# Altium schematic sheet BATT_CHG.SchDoc
size C; SheetNumber: 5; SheetTotal: 8
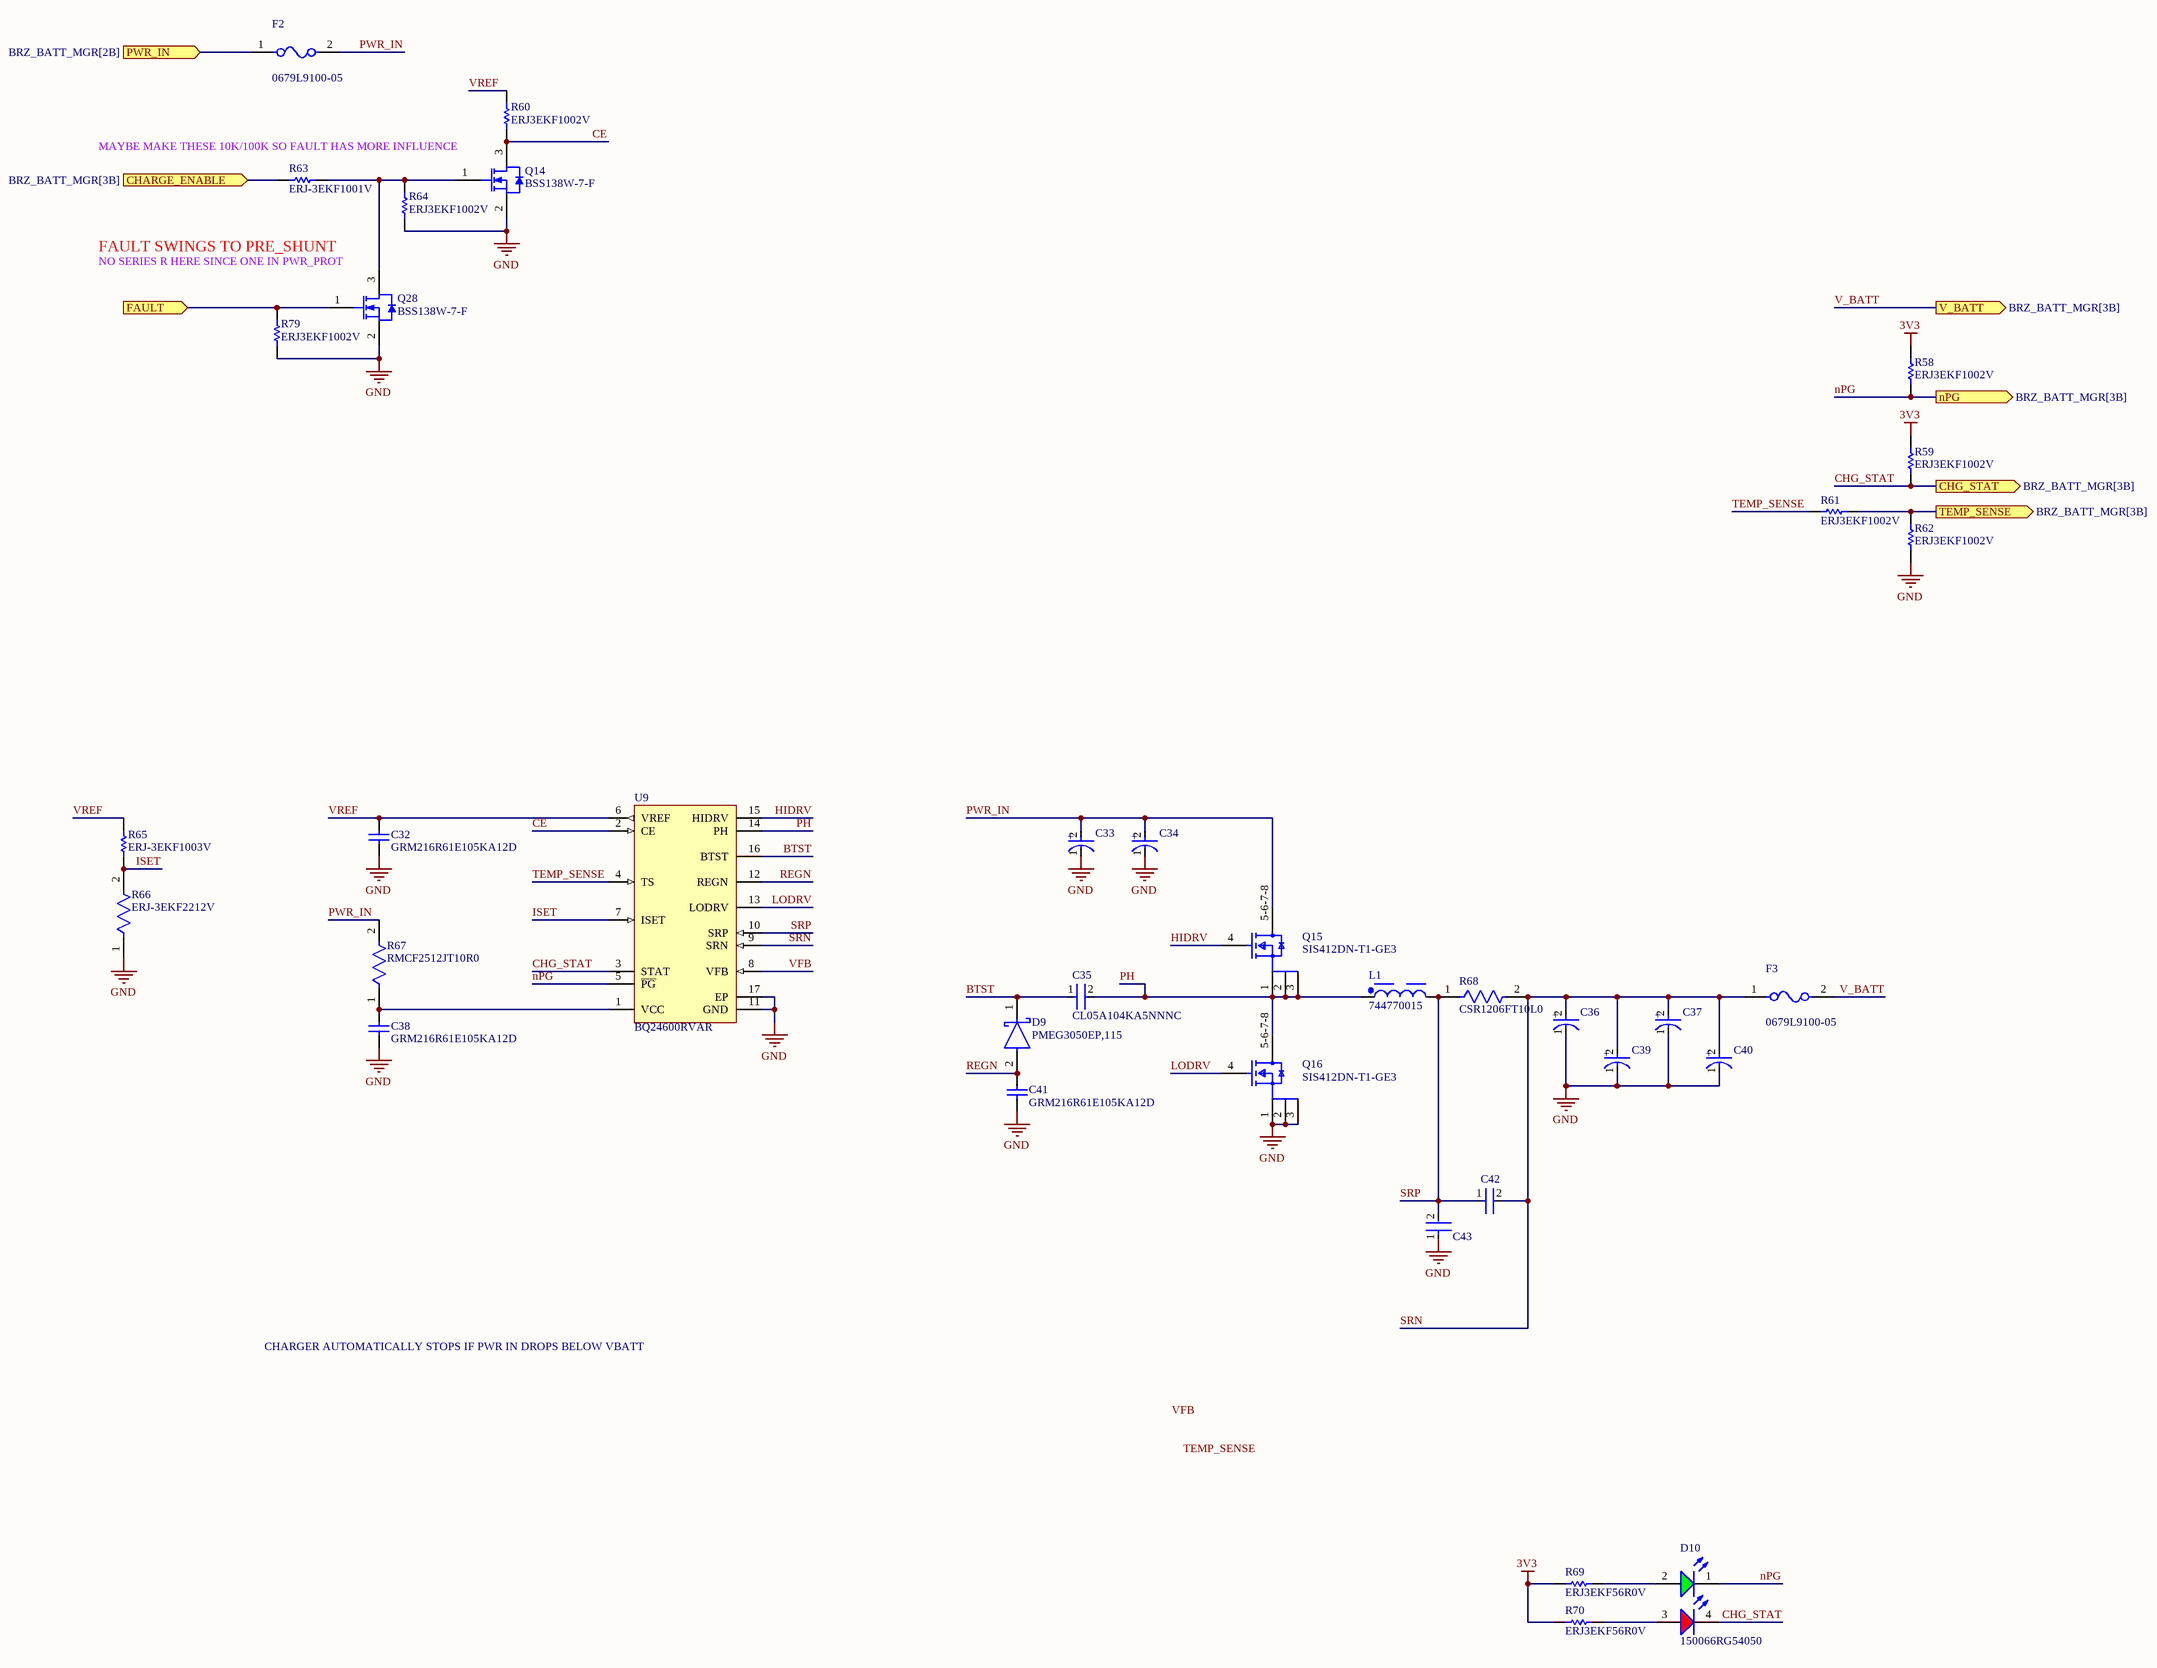
[diagram p0: BATT_CHG.SchDoc]

## Parts
C32  GRM216R61E105KA12D  [CAPC2013X70X45NL10T25]
C33  50SVPF10M  [FP-OS-CON-SMT-C6-MFG]  (value not drawn)
C34  50SVPF10M  [FP-OS-CON-SMT-C6-MFG]  (value not drawn)
C35  CL05A104KA5NNNC  [FP-CL278-IPC_C]
C36  50SVPF10M  [FP-OS-CON-SMT-C6-MFG]  (value not drawn)
C37  50SVPF10M  [FP-OS-CON-SMT-C6-MFG]  (value not drawn)
C38  GRM216R61E105KA12D  [CAPC2013X70X45NL10T25]
C39  50SVPF10M  [FP-OS-CON-SMT-C6-MFG]  (value not drawn)
C40  50SVPF10M  [FP-OS-CON-SMT-C6-MFG]  (value not drawn)
C41  GRM216R61E105KA12D  [CAPC2013X70X45NL10T25]
C42  CL05A104KA5NNNC  [FP-CL278-IPC_C]  (value not drawn)
C43  CL05A104KA5NNNC  [FP-CL278-IPC_C]  (value not drawn)
D9  PMEG3050EP,115  [FP-SOD128-MFG]
D10  150066RG54050  [WL-SBCD_0606]
F2  0679L9100-05  [FP-0679L-MFG]
F3  0679L9100-05  [FP-0679L-MFG]
L1  744770015  [WE-PD_1280]
Q14  BSS138W-7-F  [DIOD-SOT323-3_V]
Q15  SIS412DN-T1-GE3  [FP-S16-2667-SINGLE-MFG]
Q16  SIS412DN-T1-GE3  [FP-S16-2667-SINGLE-MFG]
Q28  BSS138W-7-F  [DIOD-SOT323-3_V]
R58  ERJ3EKF1002V  [RESC1609X55X30LL15T15]
R59  ERJ3EKF1002V  [RESC1609X55X30LL15T15]
R60  ERJ3EKF1002V  [RESC1609X55X30LL15T15]
R61  ERJ3EKF1002V  [RESC1609X55X30LL15T15]
R62  ERJ3EKF1002V  [RESC1609X55X30LL15T15]
R63  ERJ-3EKF1001V  [RESC1608X55X30LL15T15]
R64  ERJ3EKF1002V  [RESC1609X55X30LL15T15]
R65  ERJ-3EKF1003V  [RESC1608X55X30ML15T15]
R66  ERJ-3EKF2212V  [FP-ERJ3EK-MFG]
R67  RMCF2512JT10R0  [FP-RMCF2512-IPC_B]
R68  CSR1206FT10L0  [FP-CSR1206-IPC_C]
R69  ERJ3EKF56R0V  [RESC1608X55X30NL15T15]
R70  ERJ3EKF56R0V  [RESC1608X55X30NL15T15]
R79  ERJ3EKF1002V  [RESC1609X55X30LL15T15]
U9  BQ24600RVAR  [RVA0016A_V]

## Ports
CHARGE_ENABLE (in, see BRZ_BATT_MGR[3B]), CHG_STAT (out, see BRZ_BATT_MGR[3B]), FAULT (in), nPG (out, see BRZ_BATT_MGR[3B]), PWR_IN (in, see BRZ_BATT_MGR[2B]), TEMP_SENSE (out, see BRZ_BATT_MGR[3B]), V_BATT (out, see BRZ_BATT_MGR[3B])

## Nets
3V3: R58.2 R59.2 R69.2 R70.2
GND: C32.1 C33.1(C) C34.1(C) C36.1(C) C37.1(C) C38.1 C39.1(C) C40.1(C) C41.1 C43.1 Q14.2(S) Q16.1(S) Q16.2(S) Q16.3(S) Q28.2(S) R62.1 R64.1 R66.1 R79.1 U9.11(GND) U9.17(EP)
BTST: C35.1 D9.1(C) U9.16(BTST)
CE: Q14.3(D) R60.1 U9.2(CE)
CHARGE_ENABLE: R63.2 ; port CHARGE_ENABLE
CHG_STAT: D10.4(K) R59.1 U9.3(STAT) ; port CHG_STAT
FAULT: Q28.1(G) R79.2 ; port FAULT
HIDRV: Q15.4(G) U9.15(HIDRV)
ISET: R65.1 R66.2 U9.7(ISET)
LODRV: Q16.4(G) U9.13(LODRV)
nPG: D10.1(K) R58.1 U9.5(~{PG}) ; port nPG
PH: C35.2 L1.1 Q15.1(S) Q15.2(S) Q15.3(S) Q16.5-6-7-8(D) U9.14(PH)
PWR_IN: C33.2(A) C34.2(A) F2.2 Q15.5-6-7-8(D) R67.2
PWR_IN: F2.1 ; port PWR_IN  [a separate net that carries the same name]
REGN: C41.2 D9.2(A) U9.12(REGN)
SRN: C36.2(A) C37.2(A) C39.2(A) C40.2(A) C42.2 F3.1 R68.2 U9.9(SRN)
SRP: C42.1 C43.2 L1.2 R68.1 U9.10(SRP)
TEMP_SENSE: R61.2 U9.4(TS)
TEMP_SENSE: R61.1 R62.2 ; port TEMP_SENSE  [a separate net that carries the same name]
V_BATT: F3.2 ; port V_BATT
VFB: U9.8(VFB)
VREF: C32.2 R60.2 R65.2 U9.6(VREF)
NetC38_2: C38.2 R67.1 U9.1(VCC)
NetD10_2: D10.2(A) R69.1
NetD10_3: D10.3(A) R70.1
NetQ14_1: Q14.1(G) Q28.3(D) R63.1 R64.2

## Notes on the sheet
- MAYBE MAKE THESE 10K/100K SO FAULT HAS MORE INFLUENCE
- FAULT SWINGS TO PRE_SHUNT
- NO SERIES R HERE SINCE ONE IN PWR_PROT
- CHARGER AUTOMATICALLY STOPS IF PWR IN DROPS BELOW VBATT
- Labels drawn without touching a wire or pin: TEMP_SENSE, VFB
- (in symbol CMP-05428-000804-1) +

## Library data of the parts
C32 C38 C41 = CMP-2007-00957-1: Manufacturer: Murata; Part Number: GRM216R61E105KA12D
C33 C34 C36 C37 C39 C40 = CMP-05428-000804-1: Conductive Polymer Aluminum Solid Capacitors (OS-CON) 10uF ±20% 50V; ESR (Equivalent Series Resistance): 40mR; Ripple Current: 2.5A; Leakage Current: 100uA; Life (Hours): 5000Hour; Dissipation Factor: 12%; Voltage Rating (DC): 50V; Termination: SMD/SMT; Voltage Rating: 50V; Voltage: 50V; Min Operating Temperature: -55°C; Max Operating Temperature: 105°C; Height - Seated (Max): 0.236inch; Case/Package: Radial; Mount: Surface Mount; Height: 5.9mm; RoHS Compliant: Yes; Diameter: 6.3mm; Construction: Cylindrical; Ripple Current (AC): 2.5A; Series: OS-CON, SVPF; Length: 5.9mm; Package Quantity: 1000; REACH SVHC: No SVHC; Number of Pins: 6; Capacitance: 10uF; Packaging: Tape and Reel; Lead Free: Lead Free; Tolerance: 20%
C35 C42 C43 = CMP-13271-000728-1: Cap Ceramic 100nF 25V X5R ±10% SMD 0402 +85°C Paper T/R; Package Quantity: 1; Height: 0.5mm; Case Code (Metric): 1005; Thickness: 0.022inch; Mount: Surface Mount; Lead Free: Lead Free; Case Code (Imperial): 0402; Packaging: Tape and Reel; Depth: 0.5mm; Voltage: 25V; Min Operating Temperature: -55°C; Voltage Rating: 25V; Dielectric: X5R; Case/Package: 0402; Tolerance: 10%; Width: 0.02inch; Max Operating Temperature: 85°C; Capacitance: 100nF; Length: 1mm; Radiation Hardening: No; Voltage Rating (DC): 25V
D9 = CMP-14398-000051-1: DIODE SCHOTTKY 30V 5A SOD128; RoHS Compliant: Yes
D10 = CMP-004-00034-2: Led, Red/Grn, 180Mcd/230Mcd, 624Nm/525Nm Rohs Compliant: Yes
F2 F3 = CMP-16042-000002-1: DIFF P#!!! / FUSE BRD MNT 10A 125VAC/VDC; Manufacturer: Bel Fuse; Manufacturer Part Number: 0679L9150-01; Max Fuse Ac Voltage: 125V; Fuse Blow Speed: Fast; Fuse Current: 15A; Fuse I2T: 103.5A2Sec; Fuse Interrupt Ac Current: 50A; Automotive Grade: Grade 1; Value: 0.0038Ω; Fuse Interrupt Dc Current: 300A; Fuse Voltage Drop: 0.13V; Device Class L2: Fuses; ComponentLink2URL: https://www.belfuse.com/resources/CircuitProtection/datasheets/0679L%20Sep2016.pdf; Package: 0679L; Height: 2.79mm; Digikey Description: FUSE BRD MNT 15A 125VAC/VDC; Temperature Range High: +125°C; Device Class L3: unset; Octopart: https://octopart.com/0679l9150-01-bel+fuse-70850665; Temperature Range Low: -55°C; Max Fuse Dc Voltage: 125V; Ipc Land Pattern Name: CAPC610254X254; Category: Fuse; Lead Free: Yes; Automotive: Yes; Resistance: 0.0038Ω; RoHS: TRUE; Device Class L1: Circuit Protection; ComponentLink2Description: Datasheet; Temperature: -55°C to +125°C; Voltage Rating: 125V
L1 = CMP-03913-22866870-1: 744770015 Fixed Ind 1.5UH 10A 6 Mohm SMD; Test Frequency: 100kHz; Core Material: Ferrite; DC Resistance (DCR): 3.2mΩ; Inductance: 1.5µH; Series Resistance: 6mΩ; Current Rating: 16.5A; Self Resonant Frequency: 42MHz; Inductance Tolerance: 20%; Shielding: Shielded; Saturation Current: 12A; Width: 12mm; Mount: Surface Mount; NexarPartId: 22866870; Ambient Temperature Range Low: -40°C; Length: 12mm; Max DC Current: 10A; Resistance: 6mΩ; RMS Current (Irms): 10A; RoHS: Compliant; Case/Package: 1280; Lead Free: Lead Free; Termination: SMD/SMT; Min Operating Temperature: -40°C; Height: 8mm; Tolerance: 20%; REACH SVHC: Unknown; Max Operating Temperature: 125°C; Ambient Temperature Range High: 85°C; Packaging: Cut Tape (CT)
Q14 Q28 = CMP-2000-05968-1: N-Channel Enhancement Mode Mosfet, 50 V, 200 mA, -55 to 150 degC, 6-Pin SOT-323, RoHS, Tape and Reel; Typical Turn-Off Delay Time: 20ns; Number of Channels: 1Channel; Type: EnhancementModeFieldEffectTransistor; Brand: DiodesIncorporated; Vds - Drain-Source Breakdown Voltage: 75V; Vgs - Gate-Source Voltage: 20V; Rds On - Drain-Source Resistance: 1.4Ohms; Transistor Type: 1N-Channel; Configuration: Single; Unit Weight: 0.000212oz; Pd - Power Dissipation: 200mW; Id - Continuous Drain Current: 200mA; Forward Transconductance - Min: 0.1S; Manufacturer URL: http://www.diodes.com/; Series: BSS138; Package Description: 3-Pin Small Outline Transistor, Body 2 x 1.25 mm, Pitch 0.65 mm; Mounting Technology: SurfaceMount; Product Category: MOSFET; RoHS: True; Maximum Operating Temperature: +150C; Height: 1mm; Length: 2.2mm; Technology: Si; Width: 1.35mm; Datasheet URL: http://www.diodes.com/_files/datasheets/ds30206.pdf; Manufacturer: DiodesIncorporated; Package / Case: SOT-323-3; Typical Turn-On Delay Time: 20ns; Transistor Polarity: N-Channel; Factory Pack Quantity: 3000; Packaging: Reel; Product: MOSFETSmallSignal; Datasheet Version: Rev. 11-2, 09/2013; Package Reference: SOT323; Minimum Operating Temperature: -55C; Mounting Style: SMD/SMT; Channel Mode: Enhancement
Q15 Q16 = CMP-02550-000138-1: MOSFET N-CH 30V 12A 1212-8 PPAK; Manufacturer: Vishay; Depletion Mode: False; Max Forward Diode Voltage: 1.2V; Max Junction Temp: +150°C; Input Capacitace At Vds: 435pF @ 15V; Number Of N Channels: 1; Gate Charge At Vgs: 8nC @ 10V; Threshold Vgs Max: 2.5V; Turn On Delay Time: 5ns; Drain To Source Resistance: 0.02Ω; Rthja Max: 32°C/W; Turn Off Delay Time: 15ns; Standoff Height: 0mm; Power Dissipation: 3.2W; Pulse Drain Current: 30A; Continuous Drain Current: 8.7A; Threshold Vgs Min: 1V; Gate To Source Voltage: 20V; Typ Forward Diode Voltage: 0.8V; Reverse Recovery Charge: 7nC; Transconductance: 17S; Device Class L3: MOSFETs; Temperature Range Low: -55°C; RoHS: TRUE; Automotive: No; Lead Free: Yes; Number Of Channels: 1; Octopart: https://octopart.com/sis412dn-t1-ge3-vishay-42759401; Manufacturer Part Number: SIS412DN-T1-GE3; ComponentLink2Description: Datasheet; Digikey Description: MOSFET N-CH 30V 12A 1212-8 PPAK; Height: 1.17mm; Drain To Source Breakdown Voltage: 30V; Device Class L2: Transistors; Temperature: -55°C to +150°C; Drain To Source Voltage: 30V; Mouser Description: MOSFET 30V 12A 15.6W; Device Class L1: Discrete Semiconductors; Temperature Range High: +150°C; Category: Trans; ComponentLink2URL: http://www.vishay.com/docs/69006/sis412dn.pdf; Package: S16-2667-SINGLE; Reverse Recovery Time: 15ns
R58-R62 R64 R79 = CMP-1012-00623-3: Chip Resistor, 10 KOhm, +/- 1%, 0.1 W, -55 to 155 degC, 0603 (1608 Metric), RoHS, Tape and Reel; Manufacturer: Panasonic; Voltage Rating: 75V; Case\/Package: 0603; Power Rating: 100mW; Resistance: 10KOhm; Temperature Coefficient: 100ppm\/degreesC; Number of Pins: 2; Package Reference: 603; Depth: 0.8mm; Mount: SurfaceMount; Package Description: 2-Pin Surface Mount Device, Body 1.6 x 0.85 mm; Datasheet Version: 02/2017; Length: 1.6mm; Lead Free: LeadFree; Height: 0.45mm; Number of Terminations: 2; Max Power Dissipation: 100mW; Min Operating Temperature: -55degC; Datasheet URL: https://industrial.panasonic.com/cdbs/www-data/pdf/RDA0000/AOA0000C304.pdf; Termination: SMD/SMT; Case Code (Metric): 1608; Case Code (Imperial): 0603; Tolerance: 1%; Max Operating Temperature: 155degC; RoHSCompliant: true; Voltage Rating (DC): 75V; Radiation Hardening: No; Packaging: TapeandReel; Composition: ThickFilm; Mounting Technology: SurfaceMount; Manufacturer URL: http://www.panasonic.com/; Width: 0.031inch; REACH SVHC: NoSVHC; Contact Plating: Tin; Military Standard: Not; Package Quantity: 1
R63 = CMP-2000-00180-1: Manufacturer: Panasonic; Part Number: ERJ-3EKF1001V
R65 = CMP-2000-00182-1: Manufacturer: Panasonic; Part Number: ERJ-3EKF1003V
R66 = CMP-1012-00660-3: RES SMD 22.1K OHM 1% 1/10W 0603; Voltage Rating (DC): 50V; Power Rating: 100mW; Temperature Coefficient: 100ppm/°C; Resistance: 22.1kR; Voltage Rating: 75V; Radiation Hardening: No; Termination: SMD/SMT; Max Operating Temperature: 155°C; Series: ERJ; Technology: THICK FILM; Resistance Tolerance: 1%; Tolerance: 1%; RoHS Compliant: Yes; Length: 1.6mm; Package Quantity: 1; Case Code (Metric): 1608; Size Code: 0603; Case Code (Imperial): 0603; Military Standard: Not; Case/Package: 0603; Contact Plating: Tin; Width: 0.031inch; Packaging: Tape and Reel; REACH SVHC: No SVHC; Construction: Rectangular; Number of Terminations: 2; Max Power Dissipation: 100mW; Resistor Type: Thick Film; Height: 0.45mm; Features: Automotive AEC-Q200; Min Operating Temperature: -55°C; Lead Free: Lead Free; Depth: 0.8mm; Mount: Surface Mount
R67 = CMP-26527-002316-1: 10Ω ±5% 1W 2512 Thick Film Chip Resistor AEC-Q200 compliant; Temperature Coefficient: 200ppm/°C; Resistance: 10R; Height: 0.028inch; RoHS Compliant: Yes; Military Standard: Not; Packaging: Tape and Reel; Depth: 3.2mm; Number of Terminations: 2; Width: 0.126inch; Case Code (Imperial): 2512; Lead Free: Lead Free; Size Code: 2512; Mount: Surface Mount; Max Power Dissipation: 1W; Case/Package: 2512; Contact Plating: Tin; Radiation Hardening: No; Case Code (Metric): 6432; Length: 0.248inch; Series: RMCF; Construction: Rectangular; Features: Automotive AEC-Q200; Power Rating: 1W; Max Operating Temperature: 155°C; Resistor Type: Thick Film; Tolerance: 5%; Min Operating Temperature: -55°C
R68 = CMP-26527-001047-1: General Purpose Thick Film Chip Resistor, 1206, 10mΩ, 1%, 0.5W; Temperature Coefficient: 100ppm/°C; Max Power Dissipation: 500mW; Resistance: 10mR; Construction: Rectangular; Height: 0.026inch; Number of Terminations: 2; Max Operating Temperature: 155°C; Case/Package: 1206; Packaging: Tape and Reel; Mount: Surface Mount; Military Standard: Not; Min Operating Temperature: -55°C; RoHS Compliant: Yes; Series: CSR; Radiation Hardening: No; Case Code (Metric): 3216; Length: 0.12inch; Tolerance: 1%; Width: 0.061inch; Depth: 1.55mm; Resistor Type: Thick Film; Case Code (Imperial): 1206; Contact Plating: Tin
R69 R70 = CMP-2000-00572-1: Manufacturer: Panasonic; Part Number: ERJ3EKF56R0V
U9 = CMP-0321-00212-2: Standalone Synchronous Switch-Mode Charge Controller, 5 V, -40 to 85 degC, 16-pin VQFN (RVA), Green (RoHS & no Sb/Br); Manufacturer: Texas Instruments; Over Voltage Protection: N; Vin(Min)(V): 5; SubFamily: Battery Charge Management; Mounting Technology: Surface Mount; PartNumber: BQ24600RVAR; PackageReference: RVA0016A; ComponentLink1Description: Datasheet; ComponentLink1URL: http://www.ti.com/general/docs/lit/getliterature.tsp?genericPartNumber=BQ24600&fileType=pdf; PackageVersion: revC, May-2011; Lead Acid: N; DatasheetVersion: SLUS891A; NiCd: N; Eco-Plan: Green (RoHS & no Sb/Br); NiMH: N; Li-Ion: N; PackageDescription: 16-Pin Plastic Quad Flatpack No-Lead, 3.5 x 3.5 mm Body, 0.5 mm Pitch, Exposed Pad; Li-Polymer: N